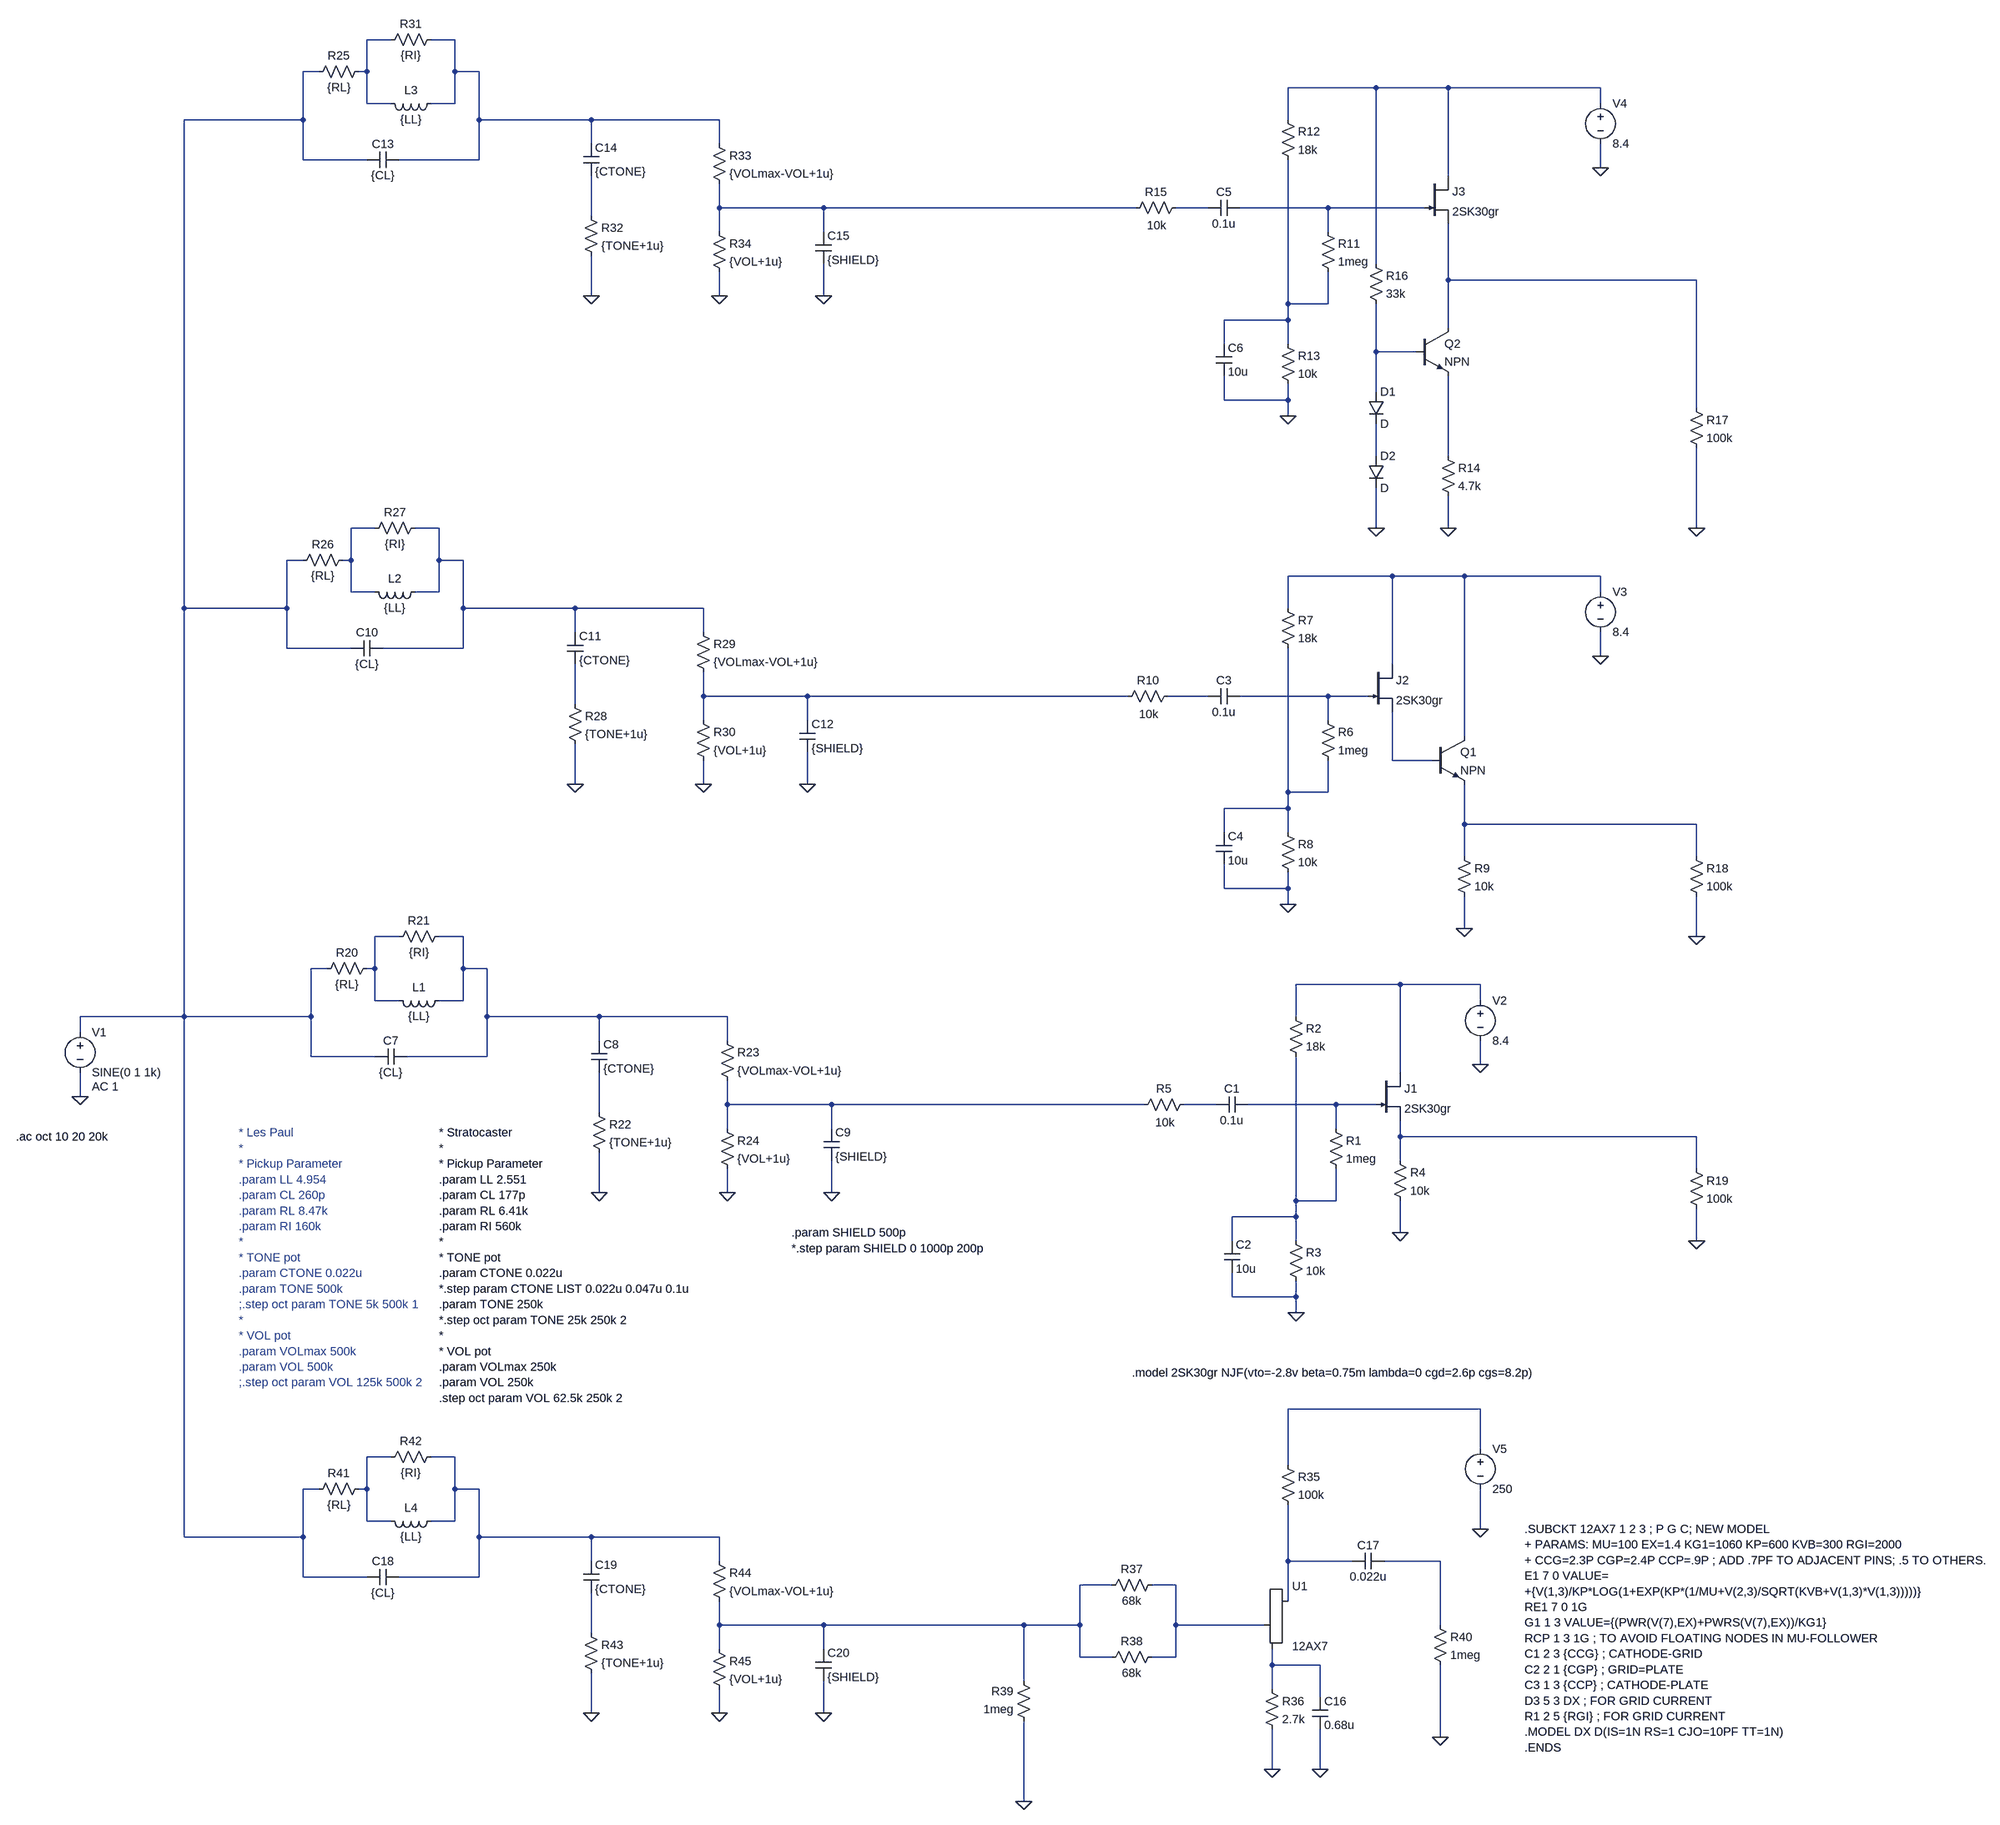
[diagram p0: schematic FET Buffer.asc]
FET Buffer.asc, the LTspice schematic file:
Version 4
SHEET 1 1708 4196
WIRE -2176 240 -2224 240
WIRE -2048 240 -2096 240
WIRE -2320 304 -2352 304
WIRE -2224 304 -2224 240
WIRE -2224 304 -2240 304
WIRE -2048 304 -2048 240
WIRE -2000 304 -2048 304
WIRE -208 336 -384 336
WIRE -64 336 -208 336
WIRE 240 336 -64 336
WIRE -2224 368 -2224 304
WIRE -2176 368 -2224 368
WIRE -2048 368 -2048 304
WIRE -2048 368 -2096 368
WIRE 240 368 240 336
WIRE -2352 400 -2352 304
WIRE -2352 400 -2704 400
WIRE -2000 400 -2000 304
WIRE -1776 400 -2000 400
WIRE -1520 400 -1776 400
WIRE -384 400 -384 336
WIRE -1776 448 -1776 400
WIRE -1520 448 -1520 400
WIRE -2352 480 -2352 400
WIRE -2224 480 -2352 480
WIRE -2000 480 -2000 400
WIRE -2000 480 -2160 480
WIRE 240 496 240 448
WIRE -64 512 -64 336
WIRE -1520 576 -1520 528
WIRE -1312 576 -1520 576
WIRE -688 576 -1312 576
WIRE -544 576 -608 576
WIRE -304 576 -480 576
WIRE -112 576 -304 576
WIRE -1776 592 -1776 512
WIRE -1520 624 -1520 576
WIRE -1312 624 -1312 576
WIRE -304 624 -304 576
WIRE -208 688 -208 336
WIRE -64 720 -64 608
WIRE 432 720 -64 720
WIRE -1776 752 -1776 672
WIRE -1520 752 -1520 704
WIRE -1312 752 -1312 688
WIRE -384 768 -384 480
WIRE -304 768 -304 704
WIRE -304 768 -384 768
WIRE -384 800 -384 768
WIRE -384 800 -512 800
WIRE -64 816 -64 720
WIRE -512 848 -512 800
WIRE -384 848 -384 800
WIRE -208 864 -208 768
WIRE -128 864 -208 864
WIRE -208 944 -208 864
WIRE -512 960 -512 912
WIRE -384 960 -384 928
WIRE -384 960 -512 960
WIRE 432 976 432 720
WIRE -384 992 -384 960
WIRE -208 1072 -208 1008
WIRE -64 1072 -64 912
WIRE -2208 1216 -2256 1216
WIRE -2080 1216 -2128 1216
WIRE -208 1216 -208 1136
WIRE -64 1216 -64 1152
WIRE 432 1216 432 1056
WIRE -2352 1280 -2384 1280
WIRE -2256 1280 -2256 1216
WIRE -2256 1280 -2272 1280
WIRE -2080 1280 -2080 1216
WIRE -2032 1280 -2080 1280
WIRE -176 1312 -384 1312
WIRE -32 1312 -176 1312
WIRE 240 1312 -32 1312
WIRE -2256 1344 -2256 1280
WIRE -2208 1344 -2256 1344
WIRE -2080 1344 -2080 1280
WIRE -2080 1344 -2128 1344
WIRE 240 1344 240 1312
WIRE -2704 1376 -2704 400
WIRE -2384 1376 -2384 1280
WIRE -2384 1376 -2704 1376
WIRE -2032 1376 -2032 1280
WIRE -1808 1376 -2032 1376
WIRE -1552 1376 -1808 1376
WIRE -384 1376 -384 1312
WIRE -1808 1424 -1808 1376
WIRE -1552 1424 -1552 1376
WIRE -2384 1456 -2384 1376
WIRE -2256 1456 -2384 1456
WIRE -2032 1456 -2032 1376
WIRE -2032 1456 -2192 1456
WIRE 240 1472 240 1424
WIRE -176 1488 -176 1312
WIRE -1552 1552 -1552 1504
WIRE -1344 1552 -1552 1552
WIRE -704 1552 -1344 1552
WIRE -544 1552 -624 1552
WIRE -304 1552 -480 1552
WIRE -224 1552 -304 1552
WIRE -1808 1568 -1808 1488
WIRE -1552 1600 -1552 1552
WIRE -1344 1600 -1344 1552
WIRE -304 1600 -304 1552
WIRE -32 1632 -32 1312
WIRE -176 1680 -176 1584
WIRE -96 1680 -176 1680
WIRE -1808 1728 -1808 1648
WIRE -1552 1728 -1552 1680
WIRE -1344 1728 -1344 1664
WIRE -384 1744 -384 1456
WIRE -304 1744 -304 1680
WIRE -304 1744 -384 1744
WIRE -384 1776 -384 1744
WIRE -384 1776 -512 1776
WIRE -32 1808 -32 1728
WIRE 432 1808 -32 1808
WIRE -512 1824 -512 1776
WIRE -384 1824 -384 1776
WIRE -32 1872 -32 1808
WIRE 432 1872 432 1808
WIRE -512 1936 -512 1888
WIRE -384 1936 -384 1904
WIRE -384 1936 -512 1936
WIRE -384 1968 -384 1936
WIRE -32 2016 -32 1952
WIRE -2160 2032 -2208 2032
WIRE -2032 2032 -2080 2032
WIRE 432 2032 432 1952
WIRE -2304 2096 -2336 2096
WIRE -2208 2096 -2208 2032
WIRE -2208 2096 -2224 2096
WIRE -2032 2096 -2032 2032
WIRE -1984 2096 -2032 2096
WIRE -160 2128 -368 2128
WIRE 0 2128 -160 2128
WIRE -2208 2160 -2208 2096
WIRE -2160 2160 -2208 2160
WIRE -2032 2160 -2032 2096
WIRE -2032 2160 -2080 2160
WIRE 0 2160 0 2128
WIRE -2704 2192 -2704 1376
WIRE -2704 2192 -2912 2192
WIRE -2336 2192 -2336 2096
WIRE -2336 2192 -2704 2192
WIRE -1984 2192 -1984 2096
WIRE -1760 2192 -1984 2192
WIRE -1504 2192 -1760 2192
WIRE -368 2192 -368 2128
WIRE -2912 2224 -2912 2192
WIRE -1760 2240 -1760 2192
WIRE -1504 2240 -1504 2192
WIRE -2336 2272 -2336 2192
WIRE -2208 2272 -2336 2272
WIRE -1984 2272 -1984 2192
WIRE -1984 2272 -2144 2272
WIRE 0 2288 0 2240
WIRE -160 2304 -160 2128
WIRE -2912 2352 -2912 2304
WIRE -1504 2368 -1504 2320
WIRE -1296 2368 -1504 2368
WIRE -672 2368 -1296 2368
WIRE -528 2368 -592 2368
WIRE -288 2368 -464 2368
WIRE -208 2368 -288 2368
WIRE -1760 2384 -1760 2304
WIRE -1504 2416 -1504 2368
WIRE -1296 2416 -1296 2368
WIRE -288 2416 -288 2368
WIRE -160 2432 -160 2400
WIRE 432 2432 -160 2432
WIRE -160 2480 -160 2432
WIRE 432 2496 432 2432
WIRE -1760 2544 -1760 2464
WIRE -1504 2544 -1504 2496
WIRE -1296 2544 -1296 2480
WIRE -368 2560 -368 2272
WIRE -288 2560 -288 2496
WIRE -288 2560 -368 2560
WIRE -368 2592 -368 2560
WIRE -368 2592 -496 2592
WIRE -160 2624 -160 2560
WIRE -496 2640 -496 2592
WIRE -368 2640 -368 2592
WIRE 432 2640 432 2576
WIRE -496 2752 -496 2704
WIRE -368 2752 -368 2720
WIRE -368 2752 -496 2752
WIRE -368 2784 -368 2752
WIRE 0 2976 -384 2976
WIRE 0 3056 0 2976
WIRE -2176 3072 -2224 3072
WIRE -2048 3072 -2096 3072
WIRE -384 3088 -384 2976
WIRE -2320 3136 -2352 3136
WIRE -2224 3136 -2224 3072
WIRE -2224 3136 -2240 3136
WIRE -2048 3136 -2048 3072
WIRE -2000 3136 -2048 3136
WIRE -2224 3200 -2224 3136
WIRE -2176 3200 -2224 3200
WIRE -2048 3200 -2048 3136
WIRE -2048 3200 -2096 3200
WIRE 0 3216 0 3136
WIRE -2704 3232 -2704 2192
WIRE -2352 3232 -2352 3136
WIRE -2352 3232 -2704 3232
WIRE -2000 3232 -2000 3136
WIRE -1776 3232 -2000 3232
WIRE -1520 3232 -1776 3232
WIRE -1776 3280 -1776 3232
WIRE -1520 3280 -1520 3232
WIRE -384 3280 -384 3168
WIRE -256 3280 -384 3280
WIRE -80 3280 -192 3280
WIRE -2352 3312 -2352 3232
WIRE -2224 3312 -2352 3312
WIRE -2000 3312 -2000 3232
WIRE -2000 3312 -2160 3312
WIRE -736 3328 -800 3328
WIRE -608 3328 -656 3328
WIRE -384 3360 -384 3280
WIRE -1520 3408 -1520 3360
WIRE -1312 3408 -1520 3408
WIRE -912 3408 -1312 3408
WIRE -800 3408 -800 3328
WIRE -800 3408 -912 3408
WIRE -608 3408 -608 3328
WIRE -432 3408 -608 3408
WIRE -80 3408 -80 3280
WIRE -1776 3424 -1776 3344
WIRE -1520 3456 -1520 3408
WIRE -1312 3456 -1312 3408
WIRE -800 3472 -800 3408
WIRE -736 3472 -800 3472
WIRE -608 3472 -608 3408
WIRE -608 3472 -656 3472
WIRE -416 3488 -416 3456
WIRE -320 3488 -416 3488
WIRE -912 3520 -912 3408
WIRE -416 3536 -416 3488
WIRE -320 3552 -320 3488
WIRE -1776 3584 -1776 3504
WIRE -1520 3584 -1520 3536
WIRE -1312 3584 -1312 3520
WIRE -80 3632 -80 3488
WIRE -416 3696 -416 3616
WIRE -320 3696 -320 3616
WIRE -912 3760 -912 3600
FLAG -160 2624 0
FLAG -368 2784 0
FLAG 0 2288 0
FLAG -32 2016 0
FLAG -384 1968 0
FLAG 240 1472 0
FLAG -64 1216 0
FLAG -384 992 0
FLAG 240 496 0
FLAG -208 1216 0
FLAG 432 1216 0
FLAG 432 2032 0
FLAG 432 2640 0
FLAG -2912 2352 0
FLAG 0 3216 0
FLAG -80 3632 0
FLAG -912 3760 0
FLAG -416 3696 0
FLAG -320 3696 0
FLAG -1760 2544 0
FLAG -1504 2544 0
FLAG -1296 2544 0
FLAG -1808 1728 0
FLAG -1552 1728 0
FLAG -1344 1728 0
FLAG -1776 752 0
FLAG -1520 752 0
FLAG -1312 752 0
FLAG -1776 3584 0
FLAG -1520 3584 0
FLAG -1312 3584 0
SYMBOL njf -208 2304 R0
SYMATTR InstName J1
SYMATTR Value 2SK30gr
SYMBOL res -304 2400 R0
SYMATTR InstName R1
SYMATTR Value 1meg
SYMBOL res -384 2176 R0
SYMATTR InstName R2
SYMATTR Value 18k
SYMBOL res -384 2624 R0
SYMATTR InstName R3
SYMATTR Value 10k
SYMBOL res -176 2464 R0
SYMATTR InstName R4
SYMATTR Value 10k
SYMBOL res -576 2352 R90
WINDOW 0 0 56 VBottom 2
WINDOW 3 36 54 VTop 2
SYMATTR InstName R5
SYMATTR Value 10k
SYMBOL voltage 0 2144 R0
WINDOW 123 0 0 Left 2
WINDOW 39 0 0 Left 2
SYMATTR InstName V2
SYMATTR Value 8.4
SYMBOL cap -464 2352 R90
WINDOW 0 0 32 VBottom 2
WINDOW 3 32 32 VTop 2
SYMATTR InstName C1
SYMATTR Value 0.1u
SYMBOL cap -512 2640 R0
SYMATTR InstName C2
SYMATTR Value 10u
SYMBOL njf -224 1488 R0
SYMATTR InstName J2
SYMATTR Value 2SK30gr
SYMBOL res -320 1584 R0
SYMATTR InstName R6
SYMATTR Value 1meg
SYMBOL res -400 1360 R0
SYMATTR InstName R7
SYMATTR Value 18k
SYMBOL res -400 1808 R0
SYMATTR InstName R8
SYMATTR Value 10k
SYMBOL res -48 1856 R0
SYMATTR InstName R9
SYMATTR Value 10k
SYMBOL res -608 1536 R90
WINDOW 0 0 56 VBottom 2
WINDOW 3 36 54 VTop 2
SYMATTR InstName R10
SYMATTR Value 10k
SYMBOL voltage 240 1328 R0
WINDOW 123 0 0 Left 2
WINDOW 39 0 0 Left 2
SYMATTR InstName V3
SYMATTR Value 8.4
SYMBOL cap -480 1536 R90
WINDOW 0 0 32 VBottom 2
WINDOW 3 32 32 VTop 2
SYMATTR InstName C3
SYMATTR Value 0.1u
SYMBOL cap -528 1824 R0
SYMATTR InstName C4
SYMATTR Value 10u
SYMBOL npn -96 1632 R0
SYMATTR InstName Q1
SYMBOL njf -112 512 R0
SYMATTR InstName J3
SYMATTR Value 2SK30gr
SYMBOL res -320 608 R0
SYMATTR InstName R11
SYMATTR Value 1meg
SYMBOL res -400 384 R0
SYMATTR InstName R12
SYMATTR Value 18k
SYMBOL res -400 832 R0
SYMATTR InstName R13
SYMATTR Value 10k
SYMBOL res -80 1056 R0
SYMATTR InstName R14
SYMATTR Value 4.7k
SYMBOL res -592 560 R90
WINDOW 0 0 56 VBottom 2
WINDOW 3 36 54 VTop 2
SYMATTR InstName R15
SYMATTR Value 10k
SYMBOL voltage 240 352 R0
WINDOW 123 0 0 Left 2
WINDOW 39 0 0 Left 2
SYMATTR InstName V4
SYMATTR Value 8.4
SYMBOL cap -480 560 R90
WINDOW 0 0 32 VBottom 2
WINDOW 3 32 32 VTop 2
SYMATTR InstName C5
SYMATTR Value 0.1u
SYMBOL cap -528 848 R0
SYMATTR InstName C6
SYMATTR Value 10u
SYMBOL npn -128 816 R0
SYMATTR InstName Q2
SYMBOL diode -224 944 R0
SYMATTR InstName D1
SYMBOL diode -224 1072 R0
SYMATTR InstName D2
SYMBOL res -224 672 R0
SYMATTR InstName R16
SYMATTR Value 33k
SYMBOL res 416 960 R0
SYMATTR InstName R17
SYMATTR Value 100k
SYMBOL res 416 1856 R0
SYMATTR InstName R18
SYMATTR Value 100k
SYMBOL res 416 2480 R0
SYMATTR InstName R19
SYMATTR Value 100k
SYMBOL voltage -2912 2208 R0
WINDOW 123 24 124 Left 2
WINDOW 39 0 0 Left 2
SYMATTR Value2 AC 1
SYMATTR InstName V1
SYMATTR Value SINE(0 1 1k)
SYMBOL Misc\\triode -384 3408 R0
SYMATTR InstName U1
SYMATTR Value 12AX7
SYMBOL res -400 3072 R0
SYMATTR InstName R35
SYMATTR Value 100k
SYMBOL res -432 3520 R0
SYMATTR InstName R36
SYMATTR Value 2.7k
SYMBOL cap -336 3552 R0
SYMATTR InstName C16
SYMATTR Value 0.68u
SYMBOL res -640 3312 R90
WINDOW 0 0 56 VBottom 2
WINDOW 3 32 56 VTop 2
SYMATTR InstName R37
SYMATTR Value 68k
SYMBOL res -640 3456 R90
WINDOW 0 0 56 VBottom 2
WINDOW 3 32 56 VTop 2
SYMATTR InstName R38
SYMATTR Value 68k
SYMBOL res -896 3616 R180
WINDOW 0 36 76 Left 2
WINDOW 3 36 40 Left 2
SYMATTR InstName R39
SYMATTR Value 1meg
SYMBOL voltage 0 3040 R0
WINDOW 123 0 0 Left 2
WINDOW 39 0 0 Left 2
SYMATTR InstName V5
SYMATTR Value 250
SYMBOL cap -192 3264 R90
WINDOW 0 0 32 VBottom 2
WINDOW 3 32 32 VTop 2
SYMATTR InstName C17
SYMATTR Value 0.022u
SYMBOL res -96 3392 R0
SYMATTR InstName R40
SYMATTR Value 1meg
SYMBOL res -2208 2080 R90
WINDOW 0 0 56 VBottom 2
WINDOW 3 32 56 VTop 2
SYMATTR InstName R20
SYMATTR Value {RL}
SYMBOL res -2064 2016 R90
WINDOW 0 0 56 VBottom 2
WINDOW 3 32 56 VTop 2
SYMATTR InstName R21
SYMATTR Value {RI}
SYMBOL ind -2064 2144 R90
WINDOW 0 5 56 VBottom 2
WINDOW 3 32 56 VTop 2
SYMATTR InstName L1
SYMATTR Value {LL}
SYMBOL cap -2144 2256 R90
WINDOW 0 0 32 VBottom 2
WINDOW 3 32 32 VTop 2
SYMATTR InstName C7
SYMATTR Value {CL}
SYMBOL res -1776 2368 R0
SYMATTR InstName R22
SYMATTR Value {TONE+1u}
SYMBOL cap -1776 2240 R0
SYMATTR InstName C8
SYMATTR Value {CTONE}
SYMBOL res -1520 2224 R0
SYMATTR InstName R23
SYMATTR Value {VOLmax-VOL+1u}
SYMBOL res -1520 2400 R0
SYMATTR InstName R24
SYMATTR Value {VOL+1u}
SYMBOL cap -1312 2416 R0
SYMATTR InstName C9
SYMATTR Value {SHIELD}
SYMBOL res -2256 1264 R90
WINDOW 0 0 56 VBottom 2
WINDOW 3 32 56 VTop 2
SYMATTR InstName R26
SYMATTR Value {RL}
SYMBOL res -2112 1200 R90
WINDOW 0 0 56 VBottom 2
WINDOW 3 32 56 VTop 2
SYMATTR InstName R27
SYMATTR Value {RI}
SYMBOL ind -2112 1328 R90
WINDOW 0 5 56 VBottom 2
WINDOW 3 32 56 VTop 2
SYMATTR InstName L2
SYMATTR Value {LL}
SYMBOL cap -2192 1440 R90
WINDOW 0 0 32 VBottom 2
WINDOW 3 32 32 VTop 2
SYMATTR InstName C10
SYMATTR Value {CL}
SYMBOL res -1824 1552 R0
SYMATTR InstName R28
SYMATTR Value {TONE+1u}
SYMBOL cap -1824 1424 R0
SYMATTR InstName C11
SYMATTR Value {CTONE}
SYMBOL res -1568 1408 R0
SYMATTR InstName R29
SYMATTR Value {VOLmax-VOL+1u}
SYMBOL res -1568 1584 R0
SYMATTR InstName R30
SYMATTR Value {VOL+1u}
SYMBOL cap -1360 1600 R0
SYMATTR InstName C12
SYMATTR Value {SHIELD}
SYMBOL res -2224 288 R90
WINDOW 0 0 56 VBottom 2
WINDOW 3 32 56 VTop 2
SYMATTR InstName R25
SYMATTR Value {RL}
SYMBOL res -2080 224 R90
WINDOW 0 0 56 VBottom 2
WINDOW 3 32 56 VTop 2
SYMATTR InstName R31
SYMATTR Value {RI}
SYMBOL ind -2080 352 R90
WINDOW 0 5 56 VBottom 2
WINDOW 3 32 56 VTop 2
SYMATTR InstName L3
SYMATTR Value {LL}
SYMBOL cap -2160 464 R90
WINDOW 0 0 32 VBottom 2
WINDOW 3 32 32 VTop 2
SYMATTR InstName C13
SYMATTR Value {CL}
SYMBOL res -1792 576 R0
SYMATTR InstName R32
SYMATTR Value {TONE+1u}
SYMBOL cap -1792 448 R0
SYMATTR InstName C14
SYMATTR Value {CTONE}
SYMBOL res -1536 432 R0
SYMATTR InstName R33
SYMATTR Value {VOLmax-VOL+1u}
SYMBOL res -1536 608 R0
SYMATTR InstName R34
SYMATTR Value {VOL+1u}
SYMBOL cap -1328 624 R0
SYMATTR InstName C15
SYMATTR Value {SHIELD}
SYMBOL res -2224 3120 R90
WINDOW 0 0 56 VBottom 2
WINDOW 3 32 56 VTop 2
SYMATTR InstName R41
SYMATTR Value {RL}
SYMBOL res -2080 3056 R90
WINDOW 0 0 56 VBottom 2
WINDOW 3 32 56 VTop 2
SYMATTR InstName R42
SYMATTR Value {RI}
SYMBOL ind -2080 3184 R90
WINDOW 0 5 56 VBottom 2
WINDOW 3 32 56 VTop 2
SYMATTR InstName L4
SYMATTR Value {LL}
SYMBOL cap -2160 3296 R90
WINDOW 0 0 32 VBottom 2
WINDOW 3 32 32 VTop 2
SYMATTR InstName C18
SYMATTR Value {CL}
SYMBOL res -1792 3408 R0
SYMATTR InstName R43
SYMATTR Value {TONE+1u}
SYMBOL cap -1792 3280 R0
SYMATTR InstName C19
SYMATTR Value {CTONE}
SYMBOL res -1536 3264 R0
SYMATTR InstName R44
SYMATTR Value {VOLmax-VOL+1u}
SYMBOL res -1536 3440 R0
SYMATTR InstName R45
SYMATTR Value {VOL+1u}
SYMBOL cap -1328 3456 R0
SYMATTR InstName C20
SYMATTR Value {SHIELD}
TEXT -696 2904 Left 2 !.model 2SK30gr NJF(vto=-2.8v beta=0.75m lambda=0 cgd=2.6p cgs=8.2p)
TEXT -3040 2432 Left 2 !.ac oct 10 20 20k
TEXT 88 3216 Left 2 !.SUBCKT 12AX7 1 2 3 ; P G C; NEW MODEL\n+ PARAMS: MU=100 EX=1.4 KG1=1060 KP=600 KVB=300 RGI=2000\n+ CCG=2.3P CGP=2.4P CCP=.9P ; ADD .7PF TO ADJACENT PINS; .5 TO OTHERS.\nE1 7 0 VALUE=\n+{V(1,3)/KP*LOG(1+EXP(KP*(1/MU+V(2,3)/SQRT(KVB+V(1,3)*V(1,3)))))}\nRE1 7 0 1G\nG1 1 3 VALUE={(PWR(V(7),EX)+PWRS(V(7),EX))/KG1}\nRCP 1 3 1G ; TO AVOID FLOATING NODES IN MU-FOLLOWER\nC1 2 3 {CCG} ; CATHODE-GRID\nC2 2 1 {CGP} ; GRID=PLATE\nC3 1 3 {CCP} ; CATHODE-PLATE\nD3 5 3 DX ; FOR GRID CURRENT\nR1 2 5 {RGI} ; FOR GRID CURRENT\n.MODEL DX D(IS=1N RS=1 CJO=10PF TT=1N)\n.ENDS
TEXT -1376 2624 Left 2 !.param SHIELD 500p\n*.step param SHIELD 0 1000p 200p
TEXT -2080 2424 Left 2 !* Stratocaster\n*\n* Pickup Parameter\n.param LL 2.551\n.param CL 177p\n.param RL 6.41k\n.param RI 560k\n*\n* TONE pot\n.param CTONE 0.022u\n*.step param CTONE LIST 0.022u 0.047u 0.1u\n.param TONE 250k\n*.step oct param TONE 25k 250k 2\n*\n* VOL pot\n.param VOLmax 250k\n.param VOL 250k\n.step oct param VOL 62.5k 250k 2
TEXT -2480 2424 Left 2 ;* Les Paul\n*\n* Pickup Parameter\n.param LL 4.954\n.param CL 260p\n.param RL 8.47k\n.param RI 160k\n*\n* TONE pot\n.param CTONE 0.022u\n.param TONE 500k\n;.step oct param TONE 5k 500k 1\n*\n* VOL pot\n.param VOLmax 500k\n.param VOL 500k\n;.step oct param VOL 125k 500k 2

The netlist it stands for:
* FET Buffer.asc
J1 N026 N029 N031 2SK30gr
R1 N029 N032 1meg
R2 N026 N032 18k
R3 N032 0 10k
R4 N031 0 10k
R5 N028 N027 10k
V2 N026 0 8.4
C1 N029 N028 0.1u
C2 N032 0 10u
J2 N016 N019 N021 2SK30gr
R6 N019 N022 1meg
R7 N016 N022 18k
R8 N022 0 10k
R9 N023 0 10k
R10 N018 N017 10k
V3 N016 0 8.4
C3 N019 N018 0.1u
C4 N022 0 10u
Q1 N016 N021 N023 0 NPN
J3 N004 N007 N009 2SK30gr
R11 N007 N010 1meg
R12 N004 N010 18k
R13 N010 0 10k
R14 N013 0 4.7k
R15 N006 N005 10k
V4 N004 0 8.4
C5 N007 N006 0.1u
C6 N010 0 10u
Q2 N009 N011 N013 0 NPN
D1 N011 N012 D
D2 N012 0 D
R16 N004 N011 33k
R17 N009 0 100k
R18 N023 0 100k
R19 N031 0 100k
V1 N003 0 SINE(0 1 1k) AC 1
XU1 N036 N039 N041 12AX7
R35 N033 N036 100k
R36 N041 0 2.7k
C16 N041 0 0.68u
R37 N039 N038 68k
R38 N039 N038 68k
R39 0 N038 1meg
V5 N033 0 250
C17 N037 N036 0.022u
R40 N037 0 1meg
R20 N024 N003 {RL}
R21 N025 N024 {RI}
L1 N025 N024 {LL}
C7 N025 N003 {CL}
R22 N030 0 {TONE+1u}
C8 N025 N030 {CTONE}
R23 N025 N027 {VOLmax-VOL+1u}
R24 N027 0 {VOL+1u}
C9 N027 0 {SHIELD}
R26 N014 N003 {RL}
R27 N015 N014 {RI}
L2 N015 N014 {LL}
C10 N015 N003 {CL}
R28 N020 0 {TONE+1u}
C11 N015 N020 {CTONE}
R29 N015 N017 {VOLmax-VOL+1u}
R30 N017 0 {VOL+1u}
C12 N017 0 {SHIELD}
R25 N001 N003 {RL}
R31 N002 N001 {RI}
L3 N002 N001 {LL}
C13 N002 N003 {CL}
R32 N008 0 {TONE+1u}
C14 N002 N008 {CTONE}
R33 N002 N005 {VOLmax-VOL+1u}
R34 N005 0 {VOL+1u}
C15 N005 0 {SHIELD}
R41 N034 N003 {RL}
R42 N035 N034 {RI}
L4 N035 N034 {LL}
C18 N035 N003 {CL}
R43 N040 0 {TONE+1u}
C19 N035 N040 {CTONE}
R44 N035 N038 {VOLmax-VOL+1u}
R45 N038 0 {VOL+1u}
C20 N038 0 {SHIELD}
.model D D
.lib standard.dio
.model NPN NPN
.model PNP PNP
.lib standard.bjt
.model NJF NJF
.model PJF PJF
.lib standard.jft
.model 2SK30gr NJF(vto=-2.8v beta=0.75m lambda=0 cgd=2.6p cgs=8.2p)
.ac oct 10 20 20k
.SUBCKT 12AX7 1 2 3 ; P G C; NEW MODEL
+ PARAMS: MU=100 EX=1.4 KG1=1060 KP=600 KVB=300 RGI=2000
+ CCG=2.3P CGP=2.4P CCP=.9P ; ADD .7PF TO ADJACENT PINS; .5 TO OTHERS.
E1 7 0 VALUE=
+{V(1,3)/KP*LOG(1+EXP(KP*(1/MU+V(2,3)/SQRT(KVB+V(1,3)*V(1,3)))))}
RE1 7 0 1G
G1 1 3 VALUE={(PWR(V(7),EX)+PWRS(V(7),EX))/KG1}
RCP 1 3 1G ; TO AVOID FLOATING NODES IN MU-FOLLOWER
C1 2 3 {CCG} ; CATHODE-GRID
C2 2 1 {CGP} ; GRID=PLATE
C3 1 3 {CCP} ; CATHODE-PLATE
D3 5 3 DX ; FOR GRID CURRENT
R1 2 5 {RGI} ; FOR GRID CURRENT
.MODEL DX D(IS=1N RS=1 CJO=10PF TT=1N)
.ENDS
.param SHIELD 500p
*.step param SHIELD 0 1000p 200p
* Stratocaster
*
* Pickup Parameter
.param LL 2.551
.param CL 177p
.param RL 6.41k
.param RI 560k
*
* TONE pot
.param CTONE 0.022u
*.step param CTONE LIST 0.022u 0.047u 0.1u
.param TONE 250k
*.step oct param TONE 25k 250k 2
*
* VOL pot
.param VOLmax 250k
.param VOL 250k
.step oct param VOL 62.5k 250k 2
* * Les Paul
* *
* * Pickup Parameter
* .param LL 4.954
* .param CL 260p
* .param RL 8.47k
* .param RI 160k
* *
* * TONE pot
* .param CTONE 0.022u
* .param TONE 500k
* ;.step oct param TONE 5k 500k 1
* *
* * VOL pot
* .param VOLmax 500k
* .param VOL 500k
* ;.step oct param VOL 125k 500k 2
.backanno
.end